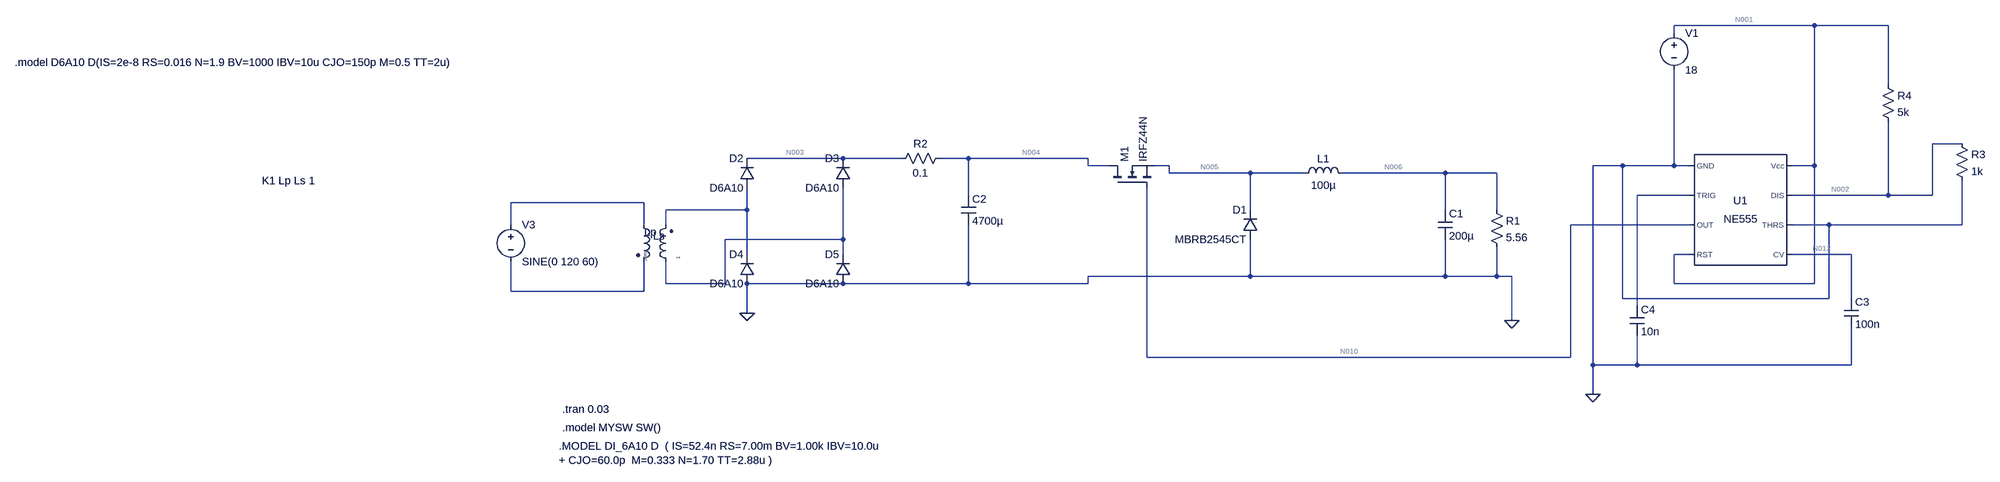
[diagram p0: schematic Buck-Elect Pot.asc]
Buck-Elect Pot.asc, the LTspice schematic file:
Version 4.1
SHEET 1 1176 708
WIRE 800 -256 496 -256
WIRE 960 -256 800 -256
WIRE 496 -240 496 -256
WIRE 960 -128 960 -256
WIRE 1120 0 1056 0
WIRE -1360 32 -1568 32
WIRE -1232 32 -1360 32
WIRE -1088 32 -1152 32
WIRE -816 32 -1088 32
WIRE -816 48 -816 32
WIRE -768 48 -816 48
WIRE -640 48 -672 48
WIRE 384 48 320 48
WIRE 496 48 496 -160
WIRE 496 48 384 48
WIRE 528 48 496 48
WIRE 800 48 800 -256
WIRE 800 48 752 48
WIRE -640 64 -640 48
WIRE -464 64 -640 64
WIRE -304 64 -464 64
WIRE 0 64 -224 64
WIRE 112 64 0 64
WIRE -1088 112 -1088 32
WIRE 528 112 416 112
WIRE 960 112 960 -48
WIRE 960 112 752 112
WIRE 1056 112 1056 0
WIRE 1056 112 960 112
WIRE -1792 128 -2080 128
WIRE -1568 144 -1568 96
WIRE -1568 144 -1744 144
WIRE -464 144 -464 64
WIRE 0 144 0 64
WIRE 112 144 112 64
WIRE -2080 176 -2080 128
WIRE -1792 176 -1792 128
WIRE -1744 176 -1744 144
WIRE 528 176 272 176
WIRE 832 176 752 176
WIRE 1120 176 1120 80
WIRE 1120 176 832 176
WIRE -1360 208 -1360 96
WIRE -1360 208 -1616 208
WIRE -1568 240 -1568 144
WIRE -1360 240 -1360 208
WIRE 528 240 496 240
WIRE 880 240 752 240
WIRE -464 288 -464 208
WIRE -464 288 -816 288
WIRE 0 288 0 208
WIRE 0 288 -464 288
WIRE 112 288 112 224
WIRE 112 288 0 288
WIRE 144 288 112 288
WIRE -1744 304 -1744 256
WIRE -1616 304 -1616 208
WIRE -1616 304 -1744 304
WIRE -1360 304 -1568 304
WIRE -1088 304 -1088 176
WIRE -1088 304 -1360 304
WIRE -816 304 -816 288
WIRE -816 304 -1088 304
WIRE 496 304 496 240
WIRE 800 304 800 48
WIRE 800 304 496 304
WIRE -2080 320 -2080 256
WIRE -1792 320 -1792 256
WIRE -1792 320 -2080 320
WIRE 384 336 384 48
WIRE 832 336 832 176
WIRE 832 336 384 336
WIRE 880 336 880 240
WIRE 416 352 416 112
WIRE -1568 368 -1568 304
WIRE 144 384 144 288
WIRE -688 464 -688 96
WIRE 272 464 272 176
WIRE 272 464 -688 464
WIRE 320 480 320 48
WIRE 416 480 416 416
WIRE 416 480 320 480
WIRE 880 480 880 400
WIRE 880 480 416 480
WIRE 320 544 320 480
FLAG 144 384 0
FLAG -1568 368 0
FLAG 320 544 0
SYMBOL res 96 128 R0
SYMATTR InstName R1
SYMATTR Value 5.56
SYMBOL cap -16 144 R0
SYMATTR InstName C1
SYMATTR Value 200µ
SYMBOL ind -320 80 R270
WINDOW 0 32 56 VTop 2
WINDOW 3 5 56 VBottom 2
SYMATTR InstName L1
SYMATTR Value 100µ
SYMBOL diode -448 208 R180
WINDOW 0 24 64 Left 2
WINDOW 3 24 0 Left 2
SYMATTR InstName D1
SYMATTR Value MBRB2545CT
SYMBOL nmos -768 96 R270
SYMATTR InstName M1
SYMATTR Value IRFZ44N
SYMBOL ind2 -1808 160 R0
WINDOW 3 92 91 VLeft 0
SYMATTR Value 1
SYMATTR InstName Ls
SYMATTR SpiceLine Rser=0.01
SYMBOL ind2 -1728 272 R180
WINDOW 0 63 80 Right 2
WINDOW 3 60 16 VRight 0
SYMATTR InstName Lp
SYMATTR Value 10m
SYMBOL voltage -2080 160 R0
WINDOW 123 0 0 Left 0
WINDOW 39 0 0 Left 0
SYMATTR InstName V3
SYMATTR Value SINE(0 120 60)
SYMBOL diode -1552 96 R180
WINDOW 0 24 64 Left 2
WINDOW 3 24 0 Left 2
SYMATTR InstName D2
SYMATTR Value D6A10
SYMBOL diode -1344 96 R180
WINDOW 0 24 64 Left 2
WINDOW 3 24 0 Left 2
SYMATTR InstName D3
SYMATTR Value D6A10
SYMBOL diode -1552 304 R180
WINDOW 0 24 64 Left 2
WINDOW 3 24 0 Left 2
SYMATTR InstName D4
SYMATTR Value D6A10
SYMBOL diode -1344 304 R180
WINDOW 0 24 64 Left 2
WINDOW 3 24 0 Left 2
SYMATTR InstName D5
SYMATTR Value D6A10
SYMBOL res -1136 16 R90
WINDOW 0 0 56 VBottom 2
WINDOW 3 32 56 VTop 2
SYMATTR InstName R2
SYMATTR Value 0.1
SYMATTR SpiceLine tol=5 pwr=1
SYMBOL cap -1104 112 R0
SYMATTR InstName C2
SYMATTR Value 4700µ
SYMBOL Misc\\NE555 640 144 R0
SYMATTR InstName U1
SYMBOL voltage 496 -256 R0
WINDOW 123 0 0 Left 0
WINDOW 39 0 0 Left 0
SYMATTR InstName V1
SYMATTR Value 18
SYMBOL cap 864 336 R0
SYMATTR InstName C3
SYMATTR Value 100n
SYMBOL cap 400 352 R0
SYMATTR InstName C4
SYMATTR Value 10n
SYMBOL res 1104 -16 R0
SYMATTR InstName R3
SYMATTR Value 1k
SYMBOL res 944 -144 R0
SYMATTR InstName R4
SYMATTR Value 5k
TEXT -1968 576 Left 2 !.tran 0.03
TEXT -1968 616 Left 2 !.model MYSW SW()
TEXT -1976 656 Left 2 !.MODEL DI_6A10 D  ( IS=52.4n RS=7.00m BV=1.00k IBV=10.0u\n+ CJO=60.0p  M=0.333 N=1.70 TT=2.88u )
TEXT -3240 -176 Left 2 !.model D6A10 D(IS=2e-8 RS=0.016 N=1.9 BV=1000 IBV=10u CJO=150p M=0.5 TT=2u)
TEXT -2704 80 Left 2 !K1 Lp Ls 1

The netlist it stands for:
* Buck-Elect Pot.asc
R1 N006 0 5.56
C1 N006 0 200µ
L1 N005 N006 100µ
D1 0 N005 MBRB2545CT
M1 N004 N010 N005 N005 IRFZ44N
Ls N008 N013 1 Rser=0.01
Lp N011 N009 10m
V3 N008 N013 SINE(0 120 60)
D2 N009 N003 D6A10
D3 N011 N003 D6A10
D4 0 N009 D6A10
D5 0 N011 D6A10
R2 N004 N003 0.1 tol=5 pwr=1
C2 N004 0 4700µ
X§U1 0 N007 N010 N001 N012 0 N002 N001 NE555  ; pins GND TRIG OUT RST CV THRS DIS Vcc
V1 N001 0 18
C3 N012 0 100n
C4 N007 0 10n
R3 N002 0 1k
R4 N001 N002 5k
.model D D
.lib standard.dio
.model NMOS NMOS
.model PMOS PMOS
.lib standard.mos
.tran 0.03
.model MYSW SW()
.MODEL DI_6A10 D  ( IS=52.4n RS=7.00m BV=1.00k IBV=10.0u
+ CJO=60.0p  M=0.333 N=1.70 TT=2.88u )
.model D6A10 D(IS=2e-8 RS=0.016 N=1.9 BV=1000 IBV=10u CJO=150p M=0.5 TT=2u)
K1 Lp Ls 1
.lib NE555.sub
.backanno
.end

* Results of the author's LTspice run, read from the files saved beside the schematic
* Operating Point, zero values left out:
*   V(n010) = 18 V
*   V(n012) = 12 V
*   V(n002) = 3 V
*   V(n001) = 18 V
*   I(R4) = 3 mA
*   I(V1) = -8.827 mA
*   I(R3) = 3 mA
*   Ix(u1:1) = -5.827 mA
*   Ix(u1:4) = 109.3 µA
*   Ix(u1:7) = 4.003 nA
*   Ix(u1:8) = 5.718 mA
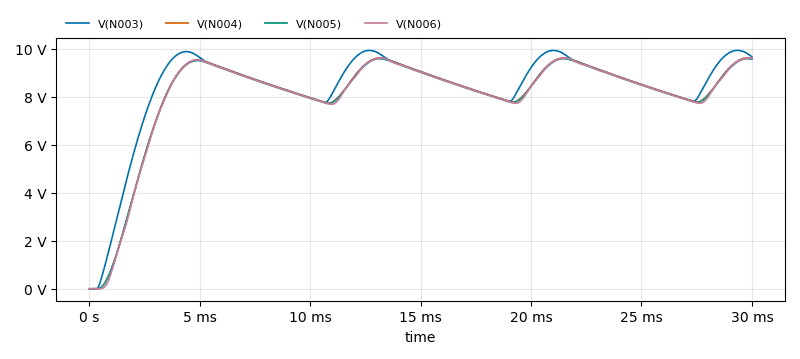
[diagram p1: Transient Analysis of Buck-Elect Pot.asc, plotted from the saved traces]
* Transient Analysis, 1 run:
*   V(N003): min 0 V, max 9.939 V, average 8.405 V, rms 8.609 V, last 9.676 V
*   V(N004): min 0 V, max 9.623 V, average 8.103 V, rms 8.354 V, last 9.602 V
*   V(N005): min 0 V, max 9.593 V, average 8.081 V, rms 8.331 V, last 9.574 V
*   V(N006): min 0 V, max 9.619 V, average 8.073 V, rms 8.329 V, last 9.611 V